# Altium schematic sheet A-01 COVER.SchDoc
size 513 x 386 mm; Address1: 350W 9th Ave; Address2: Suite 206; Address3: Escondido CA 92025; Address4: United States; Revision: -; ENG_APP_DATE: --/--/--; DSN_APP_DATE: --/--/--; CHK_APP_DATE: --/--/--
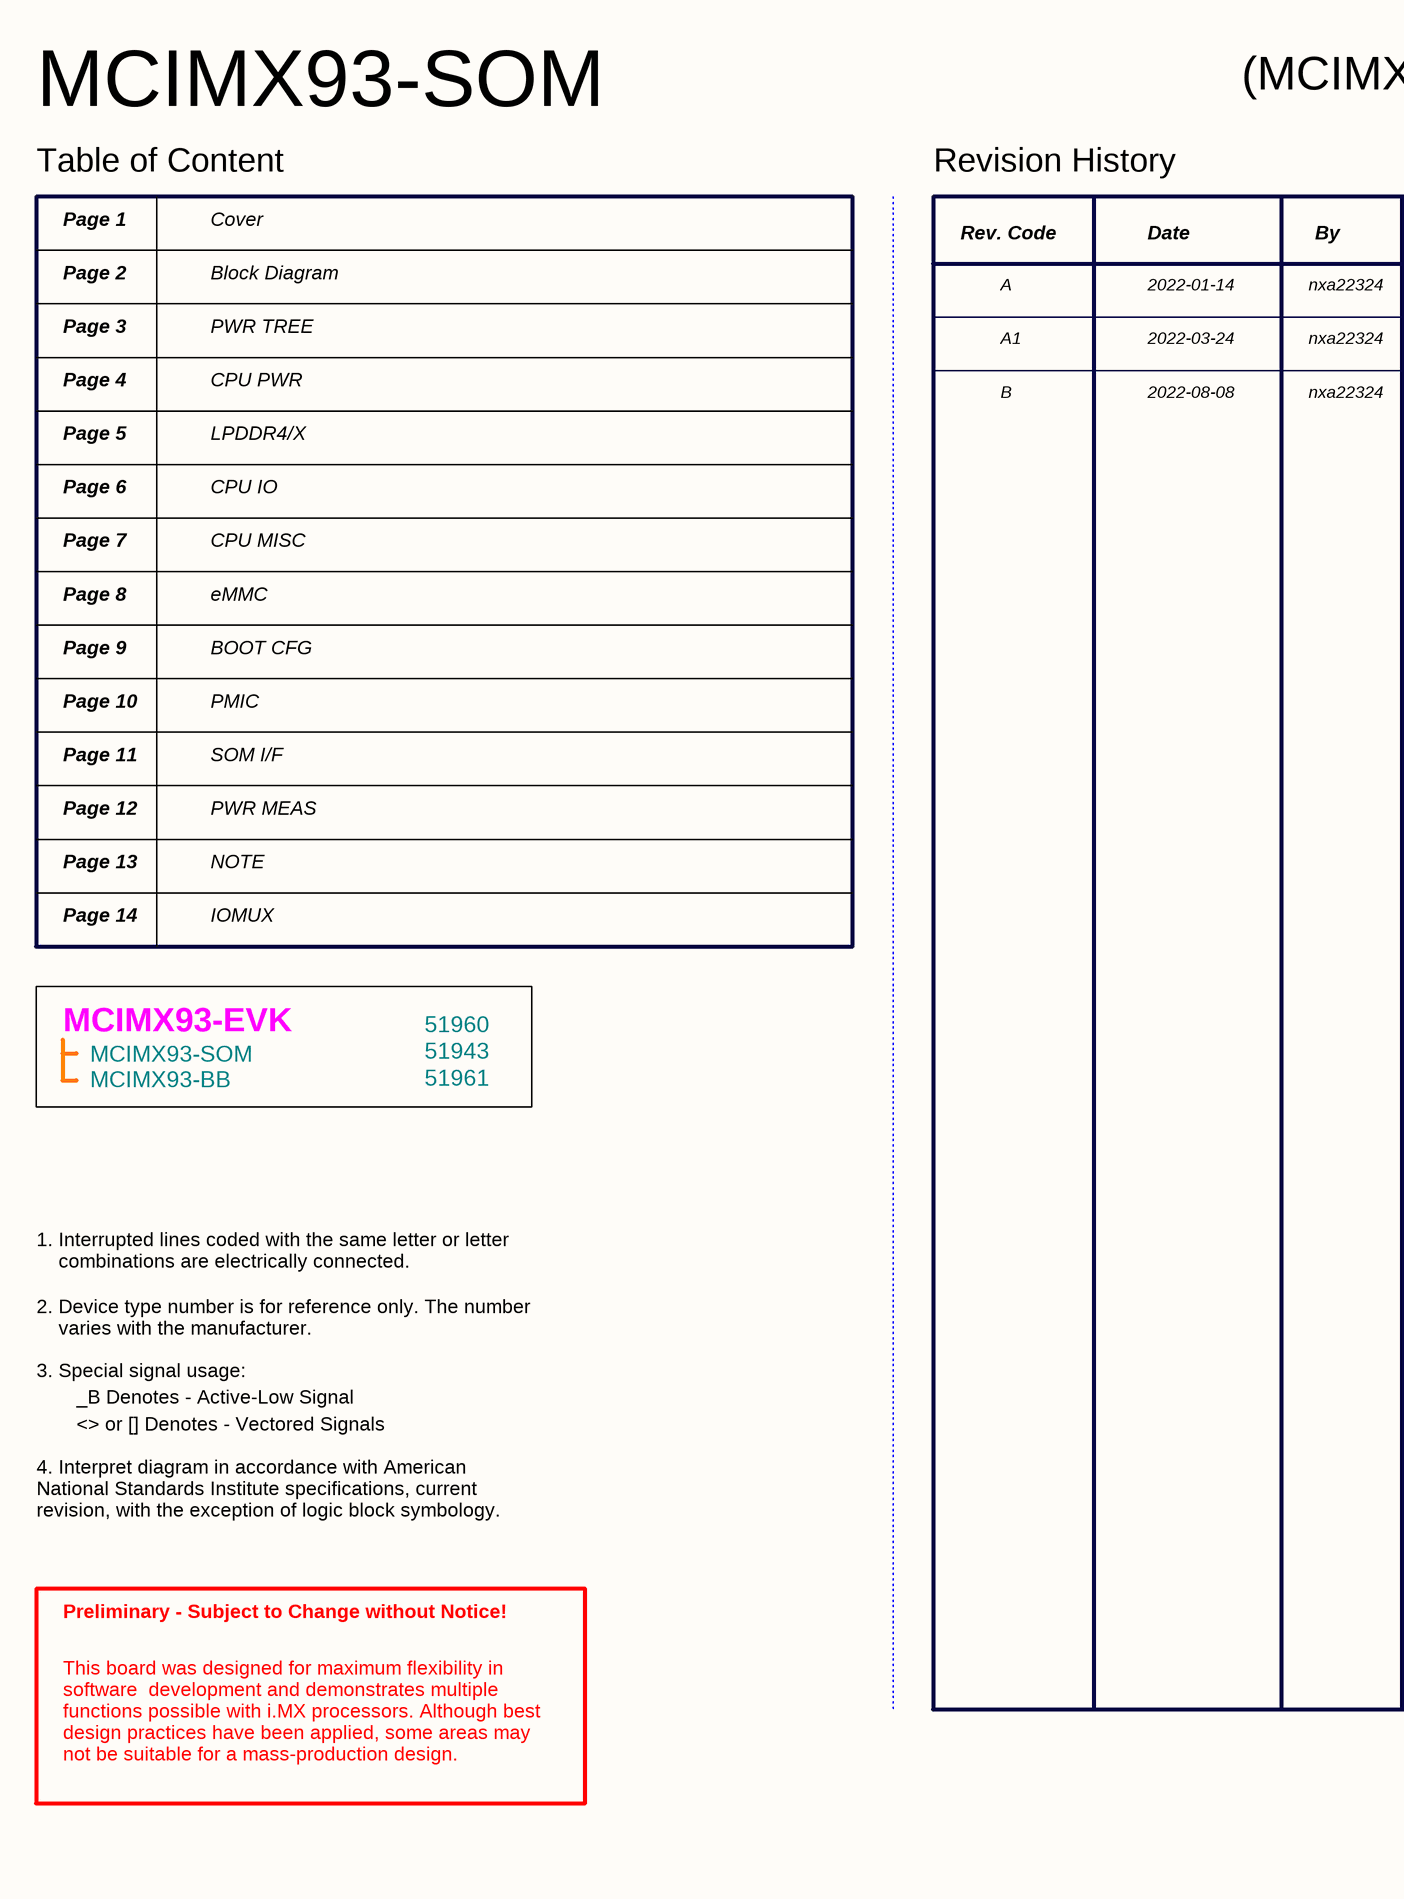
[diagram p0: A-01 COVER.SchDoc, left]
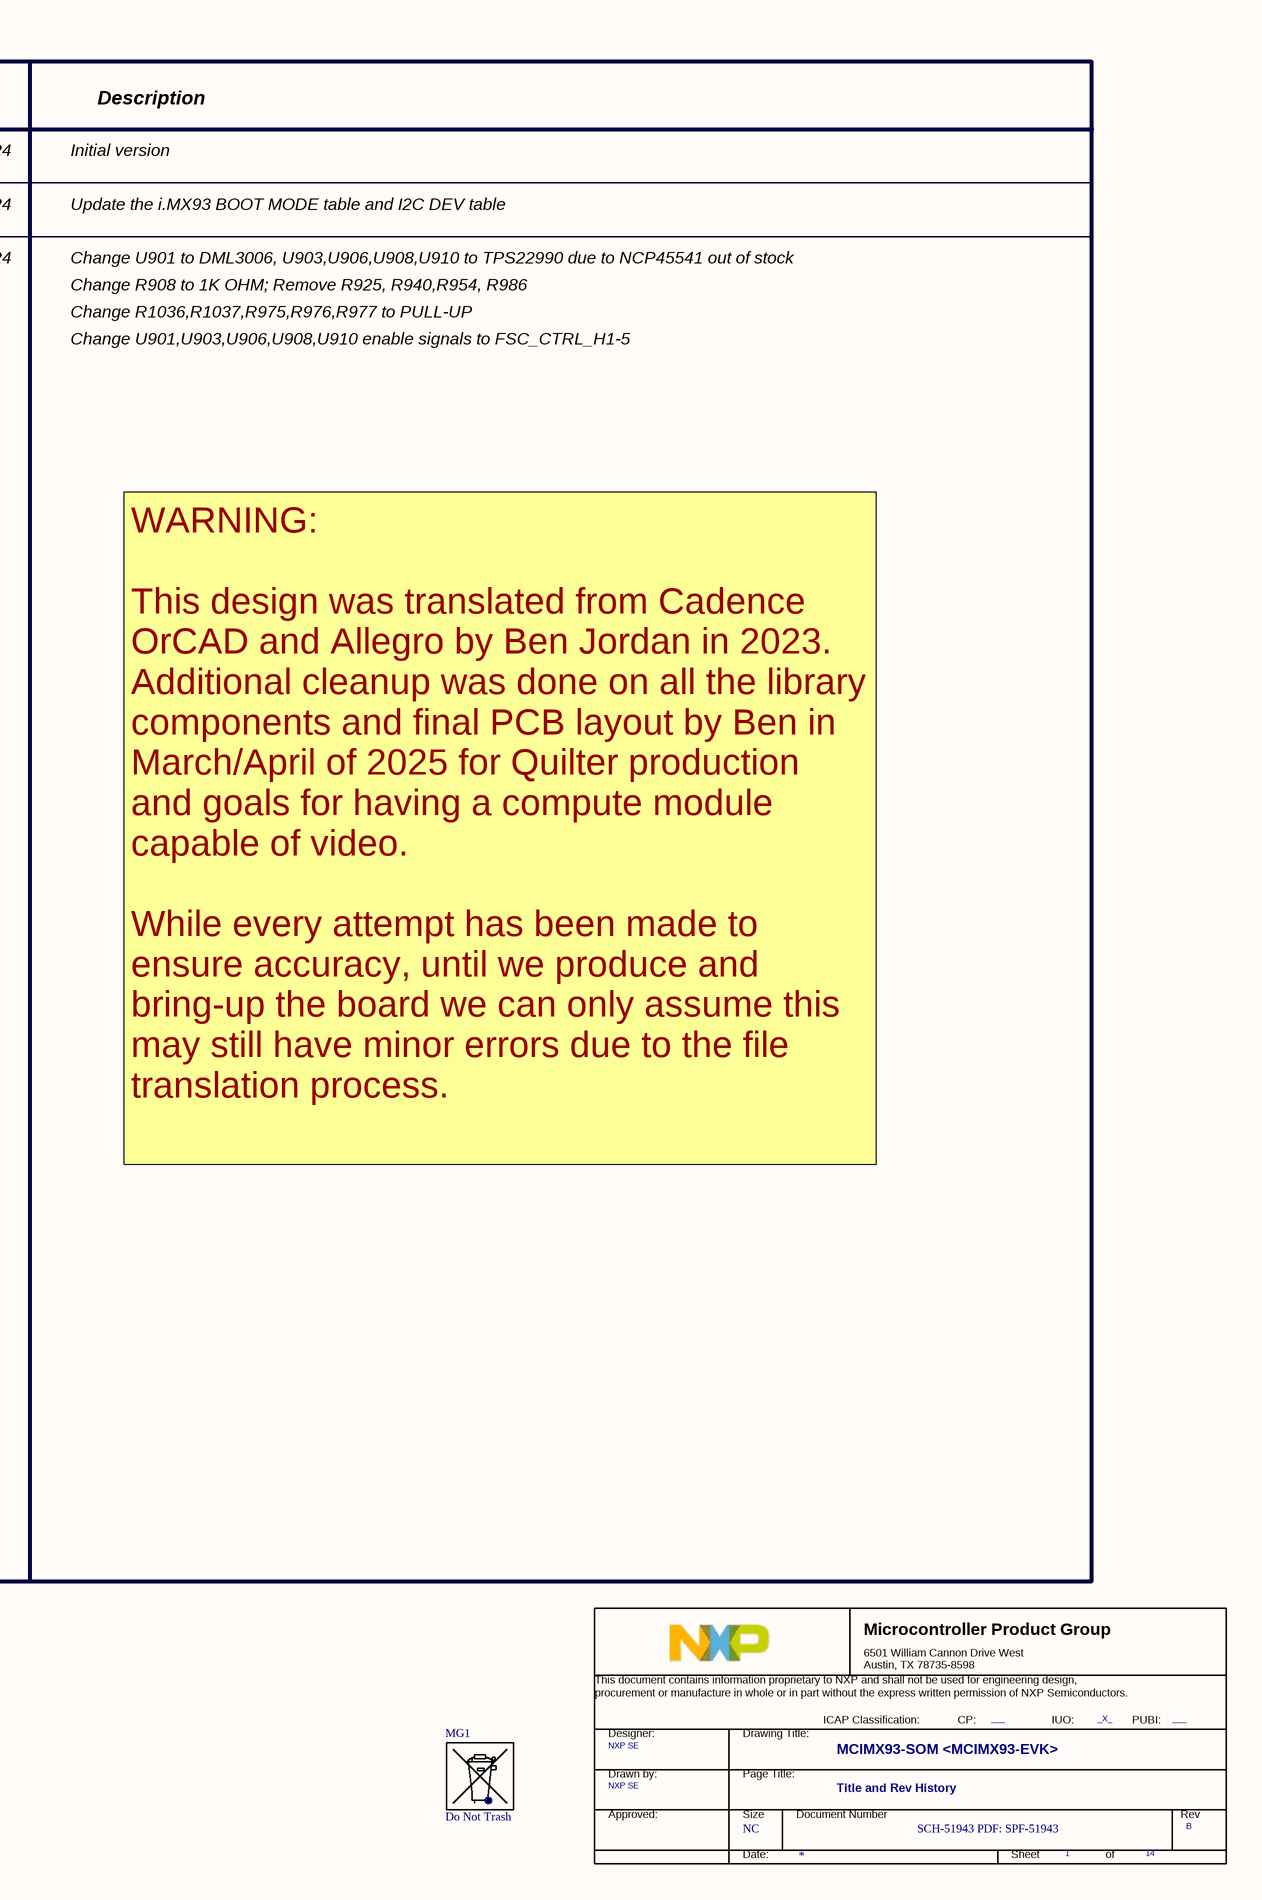
[diagram p1: A-01 COVER.SchDoc, right]

## Parts
*  Doc: SCH-51943 PDF: SPF-51943  RevCode: B  Title: MCIMX93-SOM <MCIMX93-EVK>  Page Size: NC  Page Number: 1  Page Count: 14  PageTitle: Title and Rev History  Designer: NXP SE  PUBI: ___  FIUO: _X_  (hidden comment: TitleBlock_MCPG)  (graphical)
MG1  Do Not Trash  [DoNotTrash_250Mil]  (no BOM)

## Notes on the sheet
- MCIMX93-SOM
- (MCIMX93-EVK: SOM+BB)
- Table of Content
- Revision History
- Page 1
- Page 2
- Cover
- Block Diagram
- Rev. Code
- A
- Date
- 2022-01-14
- nxa22324
- By
- Initial version
- Description
- Page 3
- PWR TREE
- A1
- 2022-03-24
- Update the i.MX93 BOOT MODE table and I2C DEV table
- Page 4
- CPU PWR
- B
- 2022-08-08
- Change U901 to DML3006, U903,U906,U908,U910 to TPS22990 due to NCP45541 out of stock
- Change R908 to 1K OHM; Remove R925, R940,R954, R986
- Page 5
- LPDDR4/X
- Change R1036,R1037,R975,R976,R977 to PULL-UP
- Change U901,U903,U906,U908,U910 enable signals to FSC_CTRL_H1-5
- Page 6
- Page 7
- CPU IO
- CPU MISC
- Page 8
- eMMC
- Page 9
- BOOT CFG
- Page 10
- PMIC
- Page 11
- Page 12
- PWR MEAS
- SOM I/F
- Page 13
- NOTE
- Page 14
- IOMUX
- MCIMX93-EVK
- MCIMX93-SOM
  MCIMX93-BB
- 51961
- 51960
- 51943
- 1. Interrupted lines coded with the same letter or letter
  combinations are electrically connected.
- WARNING:
  This design was translated from Cadence OrCAD and Allegro by Ben Jordan in 2023. Additional cleanup was done on all the library components and final PCB layout by Ben in March/April of 2025 for Quilter production and goals for having a compute module capable of video.
  While every attempt has been made to ensure accuracy, until we produce and bring-up the board we can only assume this may still have minor errors due to the file translation process.
- 2. Device type number is for reference only. The number
  varies with the manufacturer.
- 3. Special signal usage:
- _B Denotes - Active-Low Signal
- <> or [] Denotes - Vectored Signals
- 4. Interpret diagram in accordance with American
  National Standards Institute specifications, current
  revision, with the exception of logic block symbology.
- Preliminary - Subject to Change without Notice!
- This board was designed for maximum flexibility in
  software  development and demonstrates multiple
  functions possible with i.MX processors. Although best
  design practices have been applied, some areas may
  not be suitable for a mass-production design.
- 8
- 7
- 6
- 5
- 4
- 3
- 2
- 1
- REVISION
- DESCRIPTION
- DATE
- APPROVED
- F
- E
- D
- C
- PROJECT:
- REV.
- ENG:
- APPROVALS
- PROJECT
- JordanDSP LLC <https://www.jordandsp.com>
- Envision Excellence
- SHT.
- DSN:
- CHK:
- REFERENCE ITEMS
- PRJ VCS REVISION:
- TITLE
- DOC VCS REVISION:
- MODIFIED DATE:
- BOM:
- FAB DWG:
- FIRMWARE:
- ASSY DWG:
- SCALE:
- SIZE
- CAGE CODE
- FILE NAME
- DWG NO.
- PAGE
- PRODUCT REV
- OF
- (in symbol TitleBlock_MCPG) Microcontroller Product Group; 6501 William Cannon Drive West / Austin, TX 78735-8598; This document contains information proprietary to NXP and shall not be used for engineering design,; procurement or manufacture in whole or in part without the express written permission of NXP Semiconductors.; ICAP Classification:; CP:; IUO:; PUBI:; Designer:; Drawing Title:; Drawn by:; Page Title:; Approved:; Size; Document Number; Rev; Date:; Sheet; of

## Library data of the parts
* = TitleBlock_MCPG: OrgName: NXP Semiconductor; OrgAddr1: NO. 192 Liangjing Rd. Pudong New Area, ShangHai; Page Create Date: March  8, 1995; DrawnBy: NXP SE; FCP: ___; Page Modify Date: *
MG1 = CMP-00053-1: PCB Graphic Symbol - Do Not Dispose Of In Garbage (Environmental Symbol)